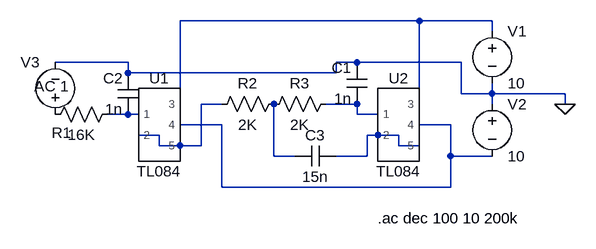
[diagram p0: schematic 实验3_2.asc]
实验3_2.asc, the LTspice schematic file:
Version 4
SHEET 1 880 680
WIRE 480 32 112 32
WIRE 592 32 480 32
WIRE 592 48 592 32
WIRE 32 96 -80 96
WIRE 384 96 352 96
WIRE 544 96 384 96
WIRE 32 112 32 96
WIRE 352 112 352 96
WIRE 352 112 32 112
WIRE 544 144 544 96
WIRE 592 144 592 128
WIRE 592 144 544 144
WIRE 704 144 592 144
WIRE 112 160 112 32
WIRE 176 160 144 160
WIRE 384 160 336 160
WIRE 480 160 480 32
WIRE 592 160 592 144
WIRE 704 160 704 144
WIRE 32 176 0 176
WIRE 48 176 32 176
WIRE 384 176 384 160
WIRE 416 176 384 176
WIRE 176 192 112 192
WIRE 528 192 480 192
WIRE 80 208 48 208
WIRE 416 208 400 208
WIRE 448 208 416 208
WIRE 80 224 80 208
WIRE 112 224 80 224
WIRE 144 224 144 160
WIRE 144 224 112 224
WIRE 448 224 448 208
WIRE 480 224 448 224
WIRE 256 240 256 160
WIRE 288 240 256 240
WIRE 400 240 400 208
WIRE 400 240 352 240
WIRE 528 240 528 192
WIRE 592 240 528 240
WIRE 176 288 176 192
WIRE 528 288 528 240
WIRE 528 288 176 288
FLAG 704 160 0
SYMBOL TL084 80 192 R0
SYMATTR InstName U1
SYMBOL TL084 448 192 R0
SYMATTR InstName U2
SYMBOL voltage 592 32 R0
WINDOW 123 0 0 Left 0
WINDOW 39 0 0 Left 0
SYMATTR InstName V1
SYMATTR Value 10
SYMBOL voltage 592 144 R0
WINDOW 123 0 0 Left 0
WINDOW 39 0 0 Left 0
SYMATTR InstName V2
SYMATTR Value 10
SYMBOL res 16 160 R90
WINDOW 0 60 86 VBottom 2
WINDOW 3 32 56 VTop 2
SYMATTR InstName R1
SYMATTR Value 16K
SYMBOL res 272 144 R90
WINDOW 0 0 56 VBottom 2
WINDOW 3 32 56 VTop 2
SYMATTR InstName R2
SYMATTR Value 2K
SYMBOL res 352 144 R90
WINDOW 0 0 56 VBottom 2
WINDOW 3 32 56 VTop 2
SYMATTR InstName R3
SYMATTR Value 2K
SYMBOL cap 400 160 R180
WINDOW 0 24 56 Left 2
WINDOW 3 24 8 Left 2
SYMATTR InstName C1
SYMATTR Value 1n
SYMBOL cap 48 176 R180
WINDOW 0 24 56 Left 2
WINDOW 3 24 8 Left 2
SYMATTR InstName C2
SYMATTR Value 1n
SYMBOL cap 288 256 R270
WINDOW 0 32 32 VTop 2
WINDOW 3 0 32 VBottom 2
SYMATTR InstName C3
SYMATTR Value 15n
SYMBOL voltage -80 192 R180
WINDOW 0 24 96 Left 2
WINDOW 3 24 16 Left 2
WINDOW 123 -21 59 Left 2
WINDOW 39 0 0 Left 0
SYMATTR InstName V3
SYMATTR Value ""
SYMATTR Value2 AC 1
TEXT 416 336 Left 2 !.ac dec 100 10 200k

The netlist it stands for:
* 实验3_2.asc
XU1 N004 N002 N001 N005 N002 TL084  ; pins 1 2 3 4 5
XU2 N003 N006 N001 N005 N006 TL084  ; pins 1 2 3 4 5
V1 N001 0 10
V2 0 N005 10
R1 N004 P001 16K
R2 N007 N002 2K
R3 N003 N007 2K
C1 N003 0 1n
C2 N004 0 1n
C3 N007 N006 15n
V3 P001 0 AC 1
.ac dec 100 10 200k
.lib C:\Users\Aristotle\Documents\LTspice\TL084.301
.backanno
.end